# Altium schematic sheet IR.SchDoc
size A4
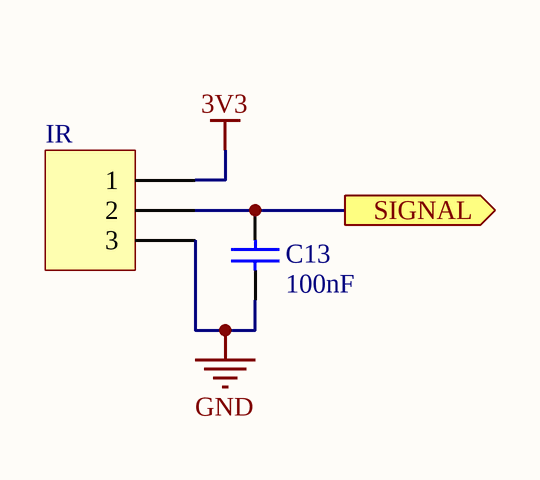
[diagram p0: IR.SchDoc]

## Parts
C13  value 100nF  [J1-0603]  (hidden comment: Cap)
IR  Header 3  [HDR1X3]  (value not drawn)

## Ports
SIGNAL (out)

## Nets
3V3: IR.1
GND: C13.1 IR.3
SIGNAL: C13.2 IR.2 ; port SIGNAL

## Library data of the parts
C13 = Cap: Capacitor; Published: 8-Jun-2000; LatestRevisionDate: 17-Jul-2002; LatestRevisionNote: Re-released for DXP Platform.; PackageReference: RAD-0.3; Publisher: Altium Limited; PackageDescription: Radial Cap, Thru-Hole; 2 Leads; 0.3 in Pin Spacing; LCSC: C153795
IR = Header 3: Header, 3-Pin; LatestRevisionDate: 17-Jul-2002; LatestRevisionNote: Re-released for DXP Platform.; Publisher: Altium Limited